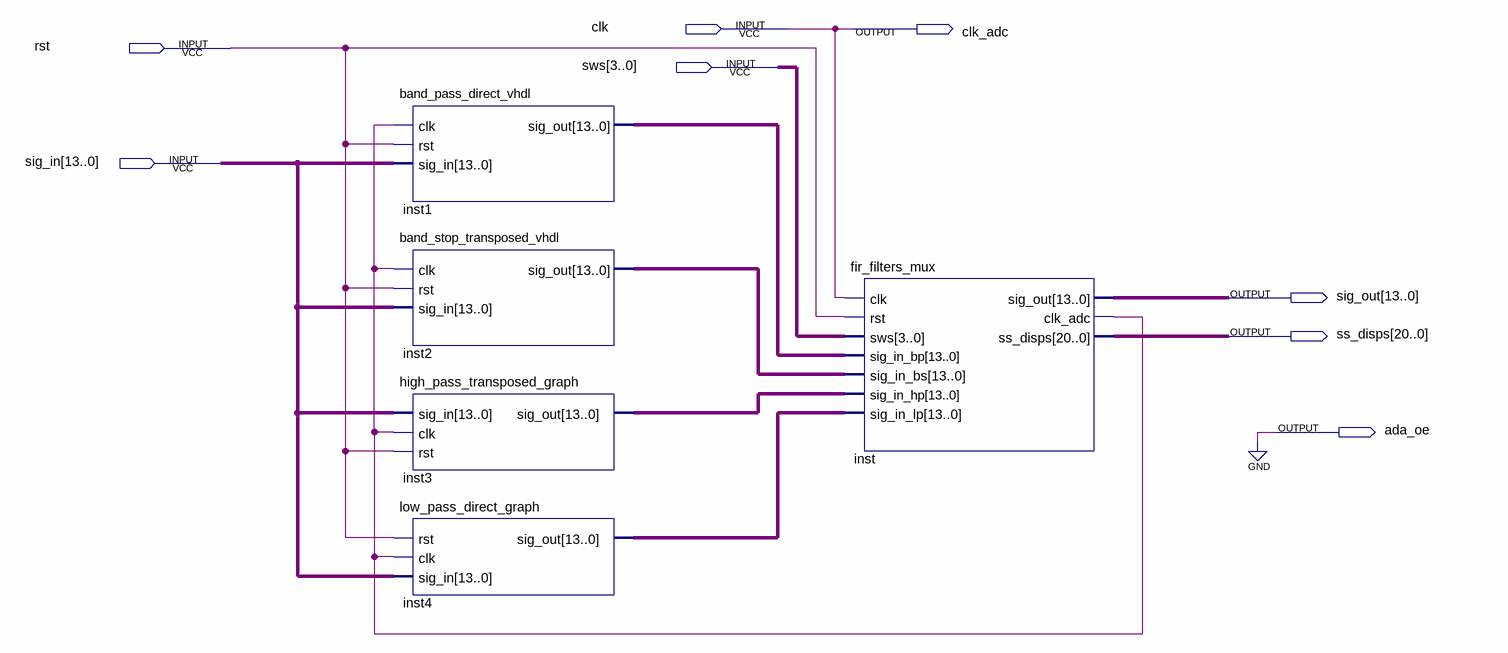
[diagram p0: schematic sheet]
// Quartus schematic fir_filters.bdf as structural Verilog: 5 symbols, 8 pins
module fir_filters (
  input  clk,
  input  rst,
  input  [3:0] sws,
  input  [13:0] sig_in,
  output clk_adc,
  output [13:0] sig_out,
  output [20:0] ss_disps,
  output ada_oe
);

  wire inst_clk_adc;
  wire [13:0] inst1_sig_out, inst2_sig_out, inst3_sig_out, inst4_sig_out;

  band_pass_direct_vhdl inst1 (.clk(inst_clk_adc), .rst(rst), .sig_in(sig_in), .sig_out(inst1_sig_out));
  band_stop_transposed_vhdl inst2 (.clk(inst_clk_adc), .rst(rst), .sig_in(sig_in), .sig_out(inst2_sig_out));
  high_pass_transposed_graph inst3 (.sig_in(sig_in), .clk(inst_clk_adc), .rst(rst), .sig_out(inst3_sig_out));
  low_pass_direct_graph inst4 (.rst(rst), .clk(inst_clk_adc), .sig_in(sig_in), .sig_out(inst4_sig_out));
  fir_filters_mux inst (
    .clk(clk), .rst(rst), .sws(sws), .sig_in_bp(inst1_sig_out), .sig_in_bs(inst2_sig_out),
    .sig_in_hp(inst3_sig_out), .sig_in_lp(inst4_sig_out), .sig_out(sig_out), .clk_adc(inst_clk_adc),
    .ss_disps(ss_disps));

  assign ada_oe = 1'b0;
  assign clk_adc = clk;
endmodule
